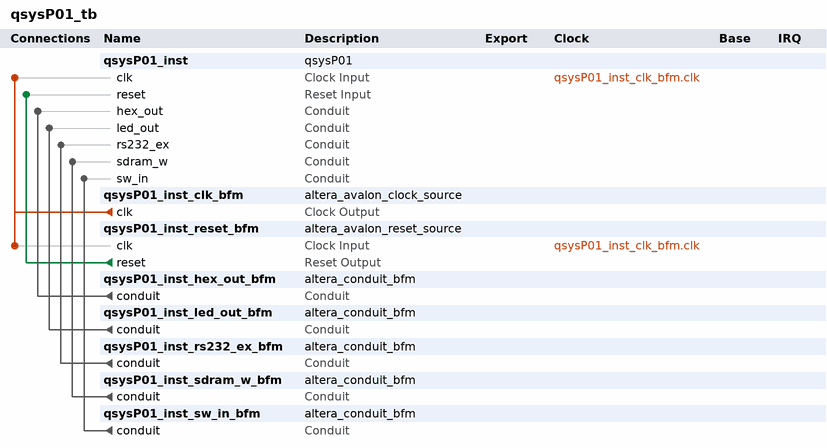
[diagram p0: system contents]
# Platform Designer (Qsys) system qsysP01_tb, Cyclone IV E EP4CE115F29C7
# Parameters at their usual value, and those the tool derives, are not listed.
package require -exact qsys 15.0
create_system qsysP01_tb
set_project_property DEVICE_FAMILY {Cyclone IV E}
set_project_property DEVICE EP4CE115F29C7

add_instance qsysP01_inst qsysP01 1.0

add_instance qsysP01_inst_clk_bfm altera_avalon_clock_source 15.0

add_instance qsysP01_inst_reset_bfm altera_avalon_reset_source 15.0
set_instance_parameter_value qsysP01_inst_reset_bfm ASSERT_HIGH_RESET 0
set_instance_parameter_value qsysP01_inst_reset_bfm INITIAL_RESET_CYCLES 50

add_instance qsysP01_inst_hex_out_bfm altera_conduit_bfm 15.0
set_instance_parameter_value qsysP01_inst_hex_out_bfm CLOCKED_SIGNAL false
set_instance_parameter_value qsysP01_inst_hex_out_bfm ENABLE_RESET false
set_instance_parameter_value qsysP01_inst_hex_out_bfm SIGNAL_DIRECTIONS input
set_instance_parameter_value qsysP01_inst_hex_out_bfm SIGNAL_WIDTHS 7

add_instance qsysP01_inst_led_out_bfm altera_conduit_bfm 15.0
set_instance_parameter_value qsysP01_inst_led_out_bfm CLOCKED_SIGNAL false
set_instance_parameter_value qsysP01_inst_led_out_bfm ENABLE_RESET false
set_instance_parameter_value qsysP01_inst_led_out_bfm SIGNAL_DIRECTIONS input
set_instance_parameter_value qsysP01_inst_led_out_bfm SIGNAL_WIDTHS 18

add_instance qsysP01_inst_rs232_ex_bfm altera_conduit_bfm 15.0
set_instance_parameter_value qsysP01_inst_rs232_ex_bfm CLOCKED_SIGNAL false
set_instance_parameter_value qsysP01_inst_rs232_ex_bfm ENABLE_RESET false
set_instance_parameter_value qsysP01_inst_rs232_ex_bfm SIGNAL_DIRECTIONS output,input
set_instance_parameter_value qsysP01_inst_rs232_ex_bfm SIGNAL_ROLES RXD,TXD
set_instance_parameter_value qsysP01_inst_rs232_ex_bfm SIGNAL_WIDTHS 1,1

add_instance qsysP01_inst_sdram_w_bfm altera_conduit_bfm 15.0
set_instance_parameter_value qsysP01_inst_sdram_w_bfm CLOCKED_SIGNAL false
set_instance_parameter_value qsysP01_inst_sdram_w_bfm ENABLE_RESET false
set_instance_parameter_value qsysP01_inst_sdram_w_bfm SIGNAL_DIRECTIONS input,input,input,input,input,bidir,input,input,input
set_instance_parameter_value qsysP01_inst_sdram_w_bfm SIGNAL_ROLES addr,ba,cas_n,cke,cs_n,dq,dqm,ras_n,we_n
set_instance_parameter_value qsysP01_inst_sdram_w_bfm SIGNAL_WIDTHS 13,2,1,1,1,32,4,1,1

add_instance qsysP01_inst_sw_in_bfm altera_conduit_bfm 15.0
set_instance_parameter_value qsysP01_inst_sw_in_bfm CLOCKED_SIGNAL false
set_instance_parameter_value qsysP01_inst_sw_in_bfm ENABLE_RESET false
set_instance_parameter_value qsysP01_inst_sw_in_bfm SIGNAL_DIRECTIONS output
set_instance_parameter_value qsysP01_inst_sw_in_bfm SIGNAL_WIDTHS 18

# connections
add_connection qsysP01_inst_clk_bfm.clk qsysP01_inst.clk clock
add_connection qsysP01_inst_clk_bfm.clk qsysP01_inst_reset_bfm.clk clock
add_connection qsysP01_inst_reset_bfm.reset qsysP01_inst.reset reset
add_connection qsysP01_inst_hex_out_bfm.conduit qsysP01_inst.hex_out conduit
add_connection qsysP01_inst_led_out_bfm.conduit qsysP01_inst.led_out conduit
add_connection qsysP01_inst_rs232_ex_bfm.conduit qsysP01_inst.rs232_ex conduit
add_connection qsysP01_inst_sdram_w_bfm.conduit qsysP01_inst.sdram_w conduit
add_connection qsysP01_inst_sw_in_bfm.conduit qsysP01_inst.sw_in conduit

set_interconnect_requirement {$system} qsys_mm.clockCrossingAdapter HANDSHAKE
set_interconnect_requirement {$system} qsys_mm.enableEccProtection FALSE
set_interconnect_requirement {$system} qsys_mm.insertDefaultSlave FALSE
set_interconnect_requirement {$system} qsys_mm.maxAdditionalLatency 1

save_system qsysP01_tb.qsys
